# Altium project REACTION-CIRCUIT.PrjPcb
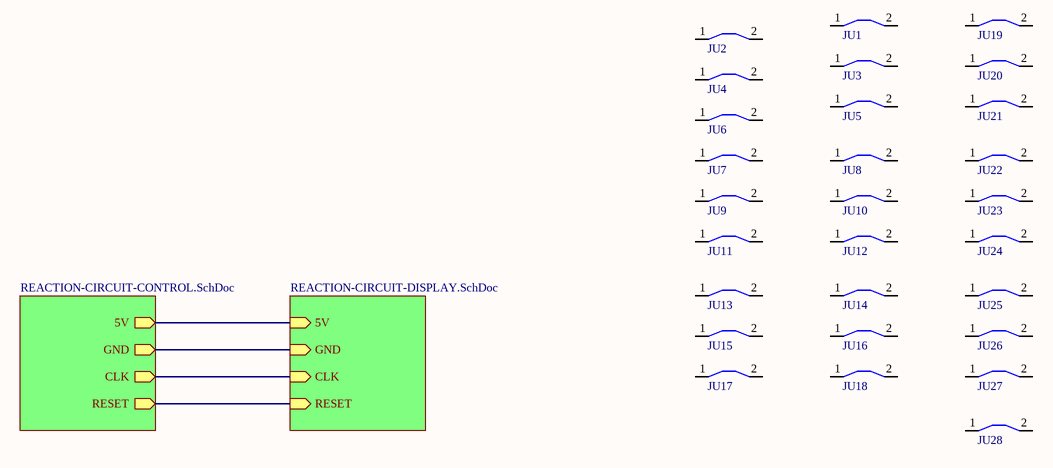
[diagram p0: REACTION-CIRCUIT.SchDoc]
3 sheets, 90 parts. Net scope: hierarchical (ports join the sheet entries above them; power ports are global).
Board file: REACTION-CIRCUIT.PcbDoc
Sheets:
  REACTION-CIRCUIT.SchDoc
    REACTION-CIRCUIT-CONTROL.SchDoc = REACTION-CIRCUIT-CONTROL.SchDoc
    REACTION-CIRCUIT-DISPLAY.SchDoc = REACTION-CIRCUIT-DISPLAY.SchDoc

## Sheet REACTION-CIRCUIT.SchDoc
size A4

### Parts
JU1  JUMPER 5MM  [JUMPER 10MM]  (value not drawn)
JU2  JUMPER 5MM  [JUMPER 10MM]  (value not drawn)
JU3  JUMPER 5MM  [JUMPER 10MM]  (value not drawn)
JU4  JUMPER 5MM  [JUMPER 10MM]  (value not drawn)
JU5  JUMPER 5MM  [JUMPER 5MM]  (value not drawn)
JU6  JUMPER 5MM  [JUMPER 5MM]  (value not drawn)
JU7  JUMPER 5MM  [JUMPER 5MM]  (value not drawn)
JU8  JUMPER 5MM  [JUMPER 5MM]  (value not drawn)
JU9  JUMPER 5MM  [JUMPER 5MM]  (value not drawn)
JU10  JUMPER 5MM  [JUMPER 5MM]  (value not drawn)
JU11  JUMPER 5MM  [JUMPER 5MM]  (value not drawn)
JU12  JUMPER 5MM  [JUMPER 5MM]  (value not drawn)
JU13  JUMPER 5MM  [JUMPER 5MM]  (value not drawn)
JU14  JUMPER 5MM  [JUMPER 5MM]  (value not drawn)
JU15  JUMPER 5MM  [JUMPER 5MM]  (value not drawn)
JU16  JUMPER 5MM  [JUMPER 5MM]  (value not drawn)
JU17  JUMPER 5MM  [JUMPER 5MM]  (value not drawn)
JU18  JUMPER 5MM  [JUMPER 5MM]  (value not drawn)
JU19  JUMPER 5MM  [JUMPER 5MM]  (value not drawn)
JU20  JUMPER 5MM  [JUMPER 5MM]  (value not drawn)
JU21  JUMPER 5MM  [JUMPER 5MM]  (value not drawn)
JU22  JUMPER 5MM  [JUMPER 5MM]  (value not drawn)
JU23  JUMPER 5MM  [JUMPER 5MM]  (value not drawn)
JU24  JUMPER 5MM  [JUMPER 5MM]  (value not drawn)
JU25  JUMPER 5MM  [JUMPER 5MM]  (value not drawn)
JU26  JUMPER 5MM  [JUMPER 5MM]  (value not drawn)
JU27  JUMPER 5MM  [JUMPER 5MM]  (value not drawn)
JU28  JUMPER 5MM  [JUMPER 5MM]  (value not drawn)

### Sub-sheets
REACTION-CIRCUIT-CONTROL.SchDoc = REACTION-CIRCUIT-CONTROL.SchDoc: 5V (out), GND (out), CLK (out), RESET (out)
REACTION-CIRCUIT-DISPLAY.SchDoc = REACTION-CIRCUIT-DISPLAY.SchDoc: 5V (in), GND (in), CLK (in), RESET (in)

### Nets
5V: sheet REACTION-CIRCUIT-CONTROL.SchDoc/5V, sheet REACTION-CIRCUIT-DISPLAY.SchDoc/5V
GND: sheet REACTION-CIRCUIT-CONTROL.SchDoc/GND, sheet REACTION-CIRCUIT-DISPLAY.SchDoc/GND
CLK_1KHz: sheet REACTION-CIRCUIT-CONTROL.SchDoc/CLK, sheet REACTION-CIRCUIT-DISPLAY.SchDoc/CLK
RESET: sheet REACTION-CIRCUIT-CONTROL.SchDoc/RESET, sheet REACTION-CIRCUIT-DISPLAY.SchDoc/RESET

Not connected (* = marked no-connect by the designer): JU1 1 2; JU2 1 2; JU3 1 2; JU4 1 2; JU5 1 2; JU6 1 2; JU7 1 2; JU8 1 2; JU9 1 2; JU10 1 2; JU11 1 2; JU12 1 2; JU13 1 2; JU14 1 2; JU15 1 2; JU16 1 2; JU17 1 2; JU18 1 2; JU19 1 2; JU20 1 2; JU21 1 2; JU22 1 2; JU23 1 2; JU24 1 2; JU25 1 2; JU26 1 2; JU27 1 2; JU28 1 2

## Sheet REACTION-CIRCUIT-CONTROL.SchDoc
size A4
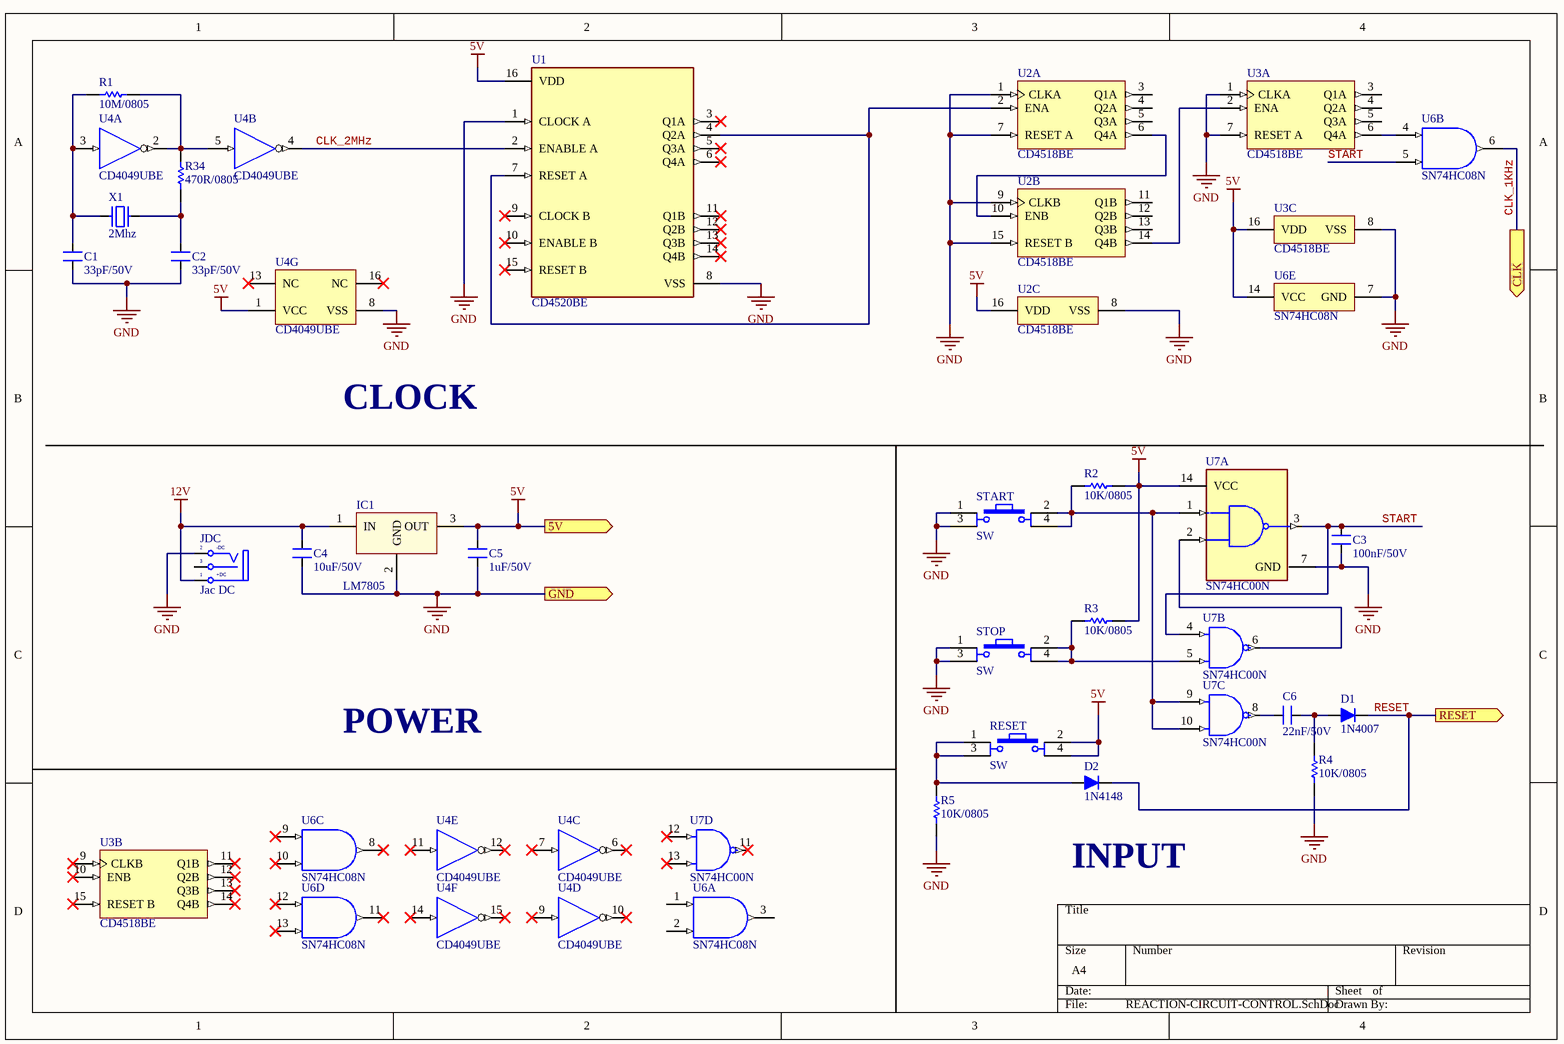
[diagram p1: REACTION-CIRCUIT-CONTROL.SchDoc]

### Parts
C1  33pF/50V  [Cap 0805(2012)]
C2  33pF/50V  [Cap 0805(2012)]
C3  100nF/50V  [Cap 0805(2012)]
C4  10uF/50V  [Cap 0805(2012)]
C5  1uF/50V  [Cap 0805(2012)]
C6  22nF/50V  [Cap 0805(2012)]
D1  1N4007  [1N4007]
D2  1N4148  [1N4007]
IC1  LM7805  [QTO-220H3]
JDC  Jac DC  [DC-IN]
R1  10M/0805  [Res 0805(2012)]
R2  10K/0805  [Res 0805(2012)]
R3  10K/0805  [Res 0805(2012)]
R4  10K/0805  [Res 0805(2012)]
R5  10K/0805  [Res 0805(2012)]
R34  470R/0805  [Res 0805(2012)]
RESET  SW  [SW4B]
START  SW  [SW4B]
STOP  SW  [SW4B]
U1  CD4520BE  [FP-N0016A-MFG]
U2  CD4518BE  [N0016A]  (parts A,B,C of 3)
U3  CD4518BE  [N0016A]  (parts A,B,C of 3)
U4  CD4049UBE  [N0016A]  (parts A,B,C,D,E,F,G of 7)
U6  SN74HC08N  [N0014A]  (parts A,B,C,D,E of 5)
U7  SN74HC00N  [FP-N0014A-MFG]  (parts A,B,C,D of 4)
X1  2Mhz  [XT2]

### Ports
5V (out), CLK (out), GND (out), RESET (out)

### Nets
5V: C5.2 IC1.3(OUT) R2.2 R3.2 RESET.2 RESET.4 U1.16(VDD) U2.16(VDD) U3.16(VDD) U4.1(VCC) U6.14(VCC) U7.14(VCC) ; port 5V
12V: C4.2 IC1.1(IN) JDC.1(T)
GND: C1.1 C2.1 C3.1 C4.1 C5.1 IC1.2(GND) JDC.2(TN) R4.2 R5.2 START.1 START.3 STOP.1 STOP.3 U1.1(CLOCK_A) U1.8(VSS) U2.1(CLKA) U2.7(RESET_A) U2.8(VSS) U2.9(CLKB) U2.15(RESET_B) U3.1(CLKA) U3.7(RESET_A) U3.8(VSS) U4.8(VSS) U6.7(GND) U7.7(GND) ; port GND
CLK_1KHz: U6.6(2Y) ; port CLK
CLK_2MHz: U1.2(ENABLE_A) U4.4(H=~{B})
RESET: D1.2(K) D2.2(K) ; port RESET
START: C3.2 U6.5(2B) U7.3(1Y) U7.4(2A)
NetC1_2: C1.2 R1.2 U4.3(A) X1.1
NetC2_2: C2.2 R34.2 X1.2
NetC6_1: C6.1 D1.1(A) R4.1
NetC6_2: C6.2 U7.8(3Y)
NetD2_1: D2.1(A) R5.1 RESET.1 RESET.3
NetR1_1: R1.1 R34.1 U4.2(G=~{A}) U4.5(B)
NetR2_1: R2.1 START.2 START.4 U7.1(1A) U7.9(3A) U7.10(3B)
NetR3_1: R3.1 STOP.2 STOP.4 U7.5(2B)
NetU1_4: U1.4(Q2A) U1.7(RESET_A) U2.2(ENA)
NetU2_6: U2.6(Q4A) U2.10(ENB)
NetU2_14: U2.14(Q4B) U3.2(ENA)
NetU3_6: U3.6(Q4A) U6.4(2A)
NetU7_2: U7.2(1B) U7.6(2Y)

Not connected (* = marked no-connect by the designer): JDC 3(S); U1 3(Q1A)* 5(Q3A)* 6(Q4A)* 9(CLOCK_B)* 10(ENABLE_B)* 11(Q1B)* 12(Q2B)* 13(Q3B)* 14(Q4B)* 15(RESET_B)*; U2 3(Q1A) 4(Q2A) 5(Q3A) 11(Q1B) 12(Q2B) 13(Q3B); U3 3(Q1A) 4(Q2A) 5(Q3A) 9(CLKB)* 10(ENB)* 11(Q1B)* 12(Q2B)* 13(Q3B)* 14(Q4B)* 15(RESET_B)*; U4 6(I=~{C})* 7(C)* 9(D)* 10(J=~{D})* 11(E)* 12(K=~{E})* 13(NC)* 14(F)* 15(L=~{F})* 16(NC)*; U6 1(1A) 2(1B) 3(1Y) 8(3Y)* 9(3A)* 10(3B)* 11(4Y)* 12(4A)* 13(4B)*; U7 11(4Y)* 12(4A)* 13(4B)*

### Notes on the sheet
- CLOCK
- POWER
- INPUT
- (in symbol DCIN) -DC; +DC

### Library data of the parts
C1-C6 = CAP_CER_1nF_50V_NPOL: Ceramic Capacitor 1nF/50V (+-20% TH)/(+10%SMD)
D1 D2 = 1N4007: Diode LS 1A 1000V DO-41
IC1 = LM78xx: On ap +, from + 5 to + 24VDC; Value: LM7805
JDC = DCIN: Jac DC input; Value: Jac DC
R1-R5 R34 = Resistor 0805
RESET START STOP = SW4: Switch button 4 pin; Value: Button chip 4 pin
U1 = CMP-1623-00555-3: IC DUAL BINARY UP COUNTER 16-DIP; Sync/Async: Synchronous; Power Dissipation: 500mW; Input Capacitance: 5pF; Frequency: 8MHz; Quiescent Current: 100uA; Min Supply Voltage: 3V; Turn-On Delay Time: 650ns; Number of Circuits: 2; Number of Bits: 4; Max Supply Voltage: 18V; Reset: Asynchronous; Logic Function: Counter; Package Quantity: 25; Min Operating Temperature: -55°C; Lead Free: Lead Free; Contact Plating: Gold; RoHS Compliant: Yes; Weight: 0.03357oz; Propagation Delay: 650ns; Number of Elements: 2; Radiation Hardening: No; Max Operating Temperature: 125°C; Mount: Through Hole; Case/Package: PDIP; Number of Pins: 16; REACH SVHC: No SVHC; Direction: Up; Packaging: Rail/Tube; Number of Bits per Element: 4
U2 U3 = CMP-1623-00558-2: CMOS Dual BCD Up-Counter, N0016A, TUBE; Manufacturer: Texas Instruments; Bits(#): 4; Schmitt Trigger: No; Inputs: 1; ICC @ Nom Voltage(Max)(mA): 0.03; Voltage(Nom)(V): 5,10,15; VCC(Min)(V): 3; VCC(Max)(V): 18; Technology Family: CD4000; F @ Nom Voltage(Max)(Mhz): 8; Output Drive (IOL/IOH)(Max)(mA): 1.5/-1.5; tpd @ Nom Voltage(Max)(ns): 230; Rating: Catalog; Output Type: CMOS; DatasheetVersion: SCHS076D; Generic Part Number: CD4518B; Type: Other; Function: Counter; Code_JEDEC: MS-001; Operating Temperature Range(C): -55 to 125; Input Type: CMOS; PackageReference: N0016A
U4 = CMP-1615-00914-2: CMOS Hex Inverting Buffer/Converter, N0016A, TUBE; Manufacturer: Texas Instruments; Rating: Military; Voltage(Nom)(V): 5; VCC(Min)(V): 3; VCC(Max)(V): 18; Output Drive (IOL/IOH)(Max)(mA): -1.2/5.2; ICC @ Nom Voltage(Max)(mA): 0.03; F @ Nom Voltage(Max)(Mhz): 12; tpd @ Nom Voltage(Max)(ns): 120; Technology Family: CD4000; Schmitt Trigger: No; Bits(#): 6; Code_JEDEC: MS-001; DatasheetVersion: SCHS046I; Generic Part Number: CD4049UB; Input Type: CMOS; Output Type: CMOS; PackageReference: N0016A; Operating Temperature Range(C): -55 to 125
U6 = CMP-0777-00250-3: Quadruple 2-Input Positive-AND Gates, N0014A, TUBE; Manufacturer: Texas Instruments; Output Type: CMOS; ICC @ Nom Voltage(Max)(mA): 0.02; tpd @ Nom Voltage(Max)(ns): 28; Voltage(Nom)(V): 5; VCC(Min)(V): 2; Technology Family: HC; F @ Nom Voltage(Max)(Mhz): 70; Rating: Catalog; Bits(#): 4; Schmitt Trigger: No; VCC(Max)(V): 6; PackageReference: N0014A; Input Type: CMOS; Generic Part Number: SN74HC08; DatasheetVersion: SCLS081F; Operating Temperature Range(C): -40 to 85
U7 = CMP-1627-00482-3: IC GATE NAND 4CH 2-INP 14DIP; Quiescent Current: 2uA; High Level Output Current: -5.2mA; Schmitt Trigger Input: No; Turn-On Delay Time: 20ns; Number of Input Lines: 2; Number of Elements: 4; Propagation Delay: 15ns; Low Level Output Current: 5.2mA; Operating Supply Voltage: 5V; Min Supply Voltage: 2V; Max Output Current: 4mA; Max Supply Voltage: 6V; Number of Outputs: 1; Width: 6.35mm; Case/Package: PDIP; Logic Function: NAND; Packaging: Rail/Tube; Number of Bits: 4; Weight: 0.032734oz; Mount: Through Hole; Length: 19.3mm; Contact Plating: Gold; Number of Inputs: 2; Radiation Hardening: No; Number of Pins: 14; Package Quantity: 25; Height: 4.57mm; Lead Free: Lead Free; Number of Circuits: 4; Output Current: 5.2mA; Min Operating Temperature: -40°C; REACH SVHC: No SVHC; Number of Output Lines: 1; Max Operating Temperature: 85°C; Number of Gates: 4
X1 = XT2: Crystal, 32.768 KHz, -40 to 85 degC, 3.2 x 1.5 x 0.9 mm SMD; Value: 4Mhz

## Sheet REACTION-CIRCUIT-DISPLAY.SchDoc
size A4
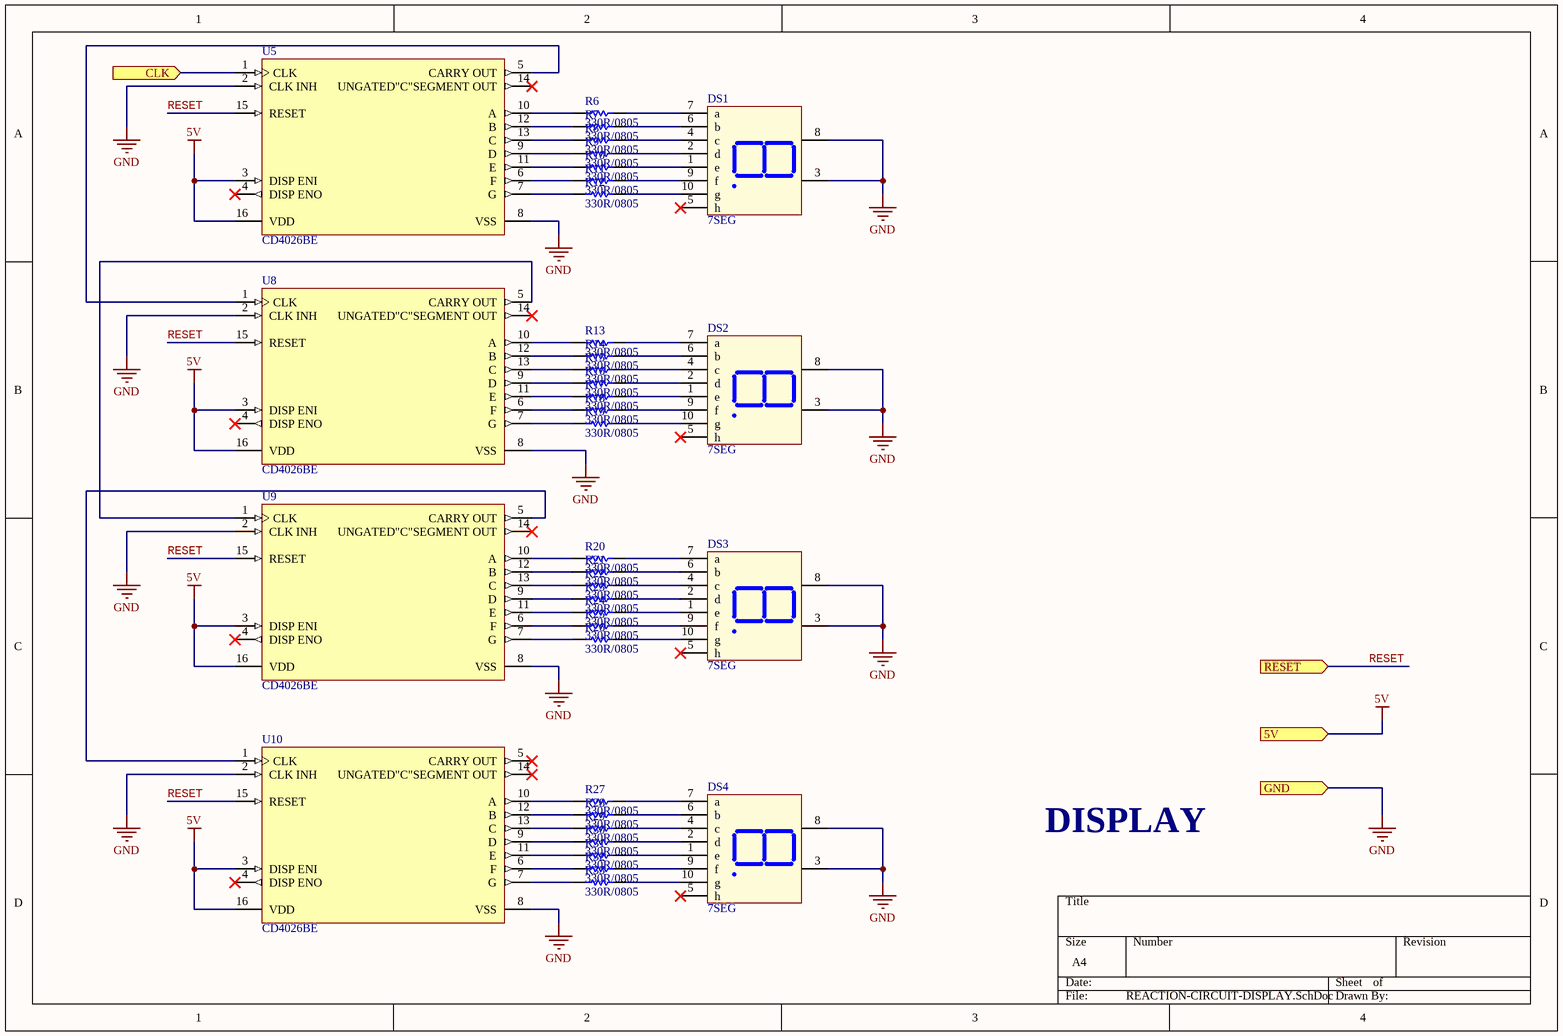
[diagram p2: REACTION-CIRCUIT-DISPLAY.SchDoc]

### Parts
DS1  7SEG  [LED7SEG-1-0.56]
DS2  7SEG  [LED7SEG-1-0.56]
DS3  7SEG  [LED7SEG-1-0.56]
DS4  7SEG  [LED7SEG-1-0.56]
R6  330R/0805  [Res 0805(2012)]
R7  330R/0805  [Res 0805(2012)]
R8  330R/0805  [Res 0805(2012)]
R9  330R/0805  [Res 0805(2012)]
R10  330R/0805  [Res 0805(2012)]
R11  330R/0805  [Res 0805(2012)]
R12  330R/0805  [Res 0805(2012)]
R13  330R/0805  [Res 0805(2012)]
R14  330R/0805  [Res 0805(2012)]
R15  330R/0805  [Res 0805(2012)]
R16  330R/0805  [Res 0805(2012)]
R17  330R/0805  [Res 0805(2012)]
R18  330R/0805  [Res 0805(2012)]
R19  330R/0805  [Res 0805(2012)]
R20  330R/0805  [Res 0805(2012)]
R21  330R/0805  [Res 0805(2012)]
R22  330R/0805  [Res 0805(2012)]
R23  330R/0805  [Res 0805(2012)]
R24  330R/0805  [Res 0805(2012)]
R25  330R/0805  [Res 0805(2012)]
R26  330R/0805  [Res 0805(2012)]
R27  330R/0805  [Res 0805(2012)]
R28  330R/0805  [Res 0805(2012)]
R29  330R/0805  [Res 0805(2012)]
R30  330R/0805  [Res 0805(2012)]
R31  330R/0805  [Res 0805(2012)]
R32  330R/0805  [Res 0805(2012)]
R33  330R/0805  [Res 0805(2012)]
U5  CD4026BE  [N0016A]
U8  CD4026BE  [N0016A]
U9  CD4026BE  [N0016A]
U10  CD4026BE  [N0016A]

### Ports
5V (in), CLK (in), GND (in), RESET (in)

### Nets
5V: U5.3(DISP_ENI) U5.16(VDD) U8.3(DISP_ENI) U8.16(VDD) U9.3(DISP_ENI) U9.16(VDD) U10.3(DISP_ENI) U10.16(VDD) ; port 5V
GND: DS1.3(Vcc) DS1.8(Vcc) DS2.3(Vcc) DS2.8(Vcc) DS3.3(Vcc) DS3.8(Vcc) DS4.3(Vcc) DS4.8(Vcc) U5.2(CLK_INH) U5.8(VSS) U8.2(CLK_INH) U8.8(VSS) U9.2(CLK_INH) U9.8(VSS) U10.2(CLK_INH) U10.8(VSS) ; port GND
CLK_1KHz: U5.1(CLK) ; port CLK
RESET: U5.15(RESET) U8.15(RESET) U9.15(RESET) U10.15(RESET) ; port RESET
NetDS1_1: DS1.1(e) R10.1
NetDS1_2: DS1.2(d) R9.1
NetDS1_4: DS1.4(c) R8.1
NetDS1_6: DS1.6(b) R7.1
NetDS1_7: DS1.7(a) R6.1
NetDS1_9: DS1.9(f) R11.1
NetDS1_10: DS1.10(g) R12.1
NetDS2_1: DS2.1(e) R17.1
NetDS2_2: DS2.2(d) R16.1
NetDS2_4: DS2.4(c) R15.1
NetDS2_6: DS2.6(b) R14.1
NetDS2_7: DS2.7(a) R13.1
NetDS2_9: DS2.9(f) R18.1
NetDS2_10: DS2.10(g) R19.1
NetDS3_1: DS3.1(e) R24.1
NetDS3_2: DS3.2(d) R23.1
NetDS3_4: DS3.4(c) R22.1
NetDS3_6: DS3.6(b) R21.1
NetDS3_7: DS3.7(a) R20.1
NetDS3_9: DS3.9(f) R25.1
NetDS3_10: DS3.10(g) R26.1
NetDS4_1: DS4.1(e) R31.1
NetDS4_2: DS4.2(d) R30.1
NetDS4_4: DS4.4(c) R29.1
NetDS4_6: DS4.6(b) R28.1
NetDS4_7: DS4.7(a) R27.1
NetDS4_9: DS4.9(f) R32.1
NetDS4_10: DS4.10(g) R33.1
NetR6_2: R6.2 U5.10(A)
NetR7_2: R7.2 U5.12(B)
NetR8_2: R8.2 U5.13(C)
NetR9_2: R9.2 U5.9(D)
NetR10_2: R10.2 U5.11(E)
NetR11_2: R11.2 U5.6(F)
NetR12_2: R12.2 U5.7(G)
NetR13_2: R13.2 U8.10(A)
NetR14_2: R14.2 U8.12(B)
NetR15_2: R15.2 U8.13(C)
NetR16_2: R16.2 U8.9(D)
NetR17_2: R17.2 U8.11(E)
NetR18_2: R18.2 U8.6(F)
NetR19_2: R19.2 U8.7(G)
NetR20_2: R20.2 U9.10(A)
NetR21_2: R21.2 U9.12(B)
NetR22_2: R22.2 U9.13(C)
NetR23_2: R23.2 U9.9(D)
NetR24_2: R24.2 U9.11(E)
NetR25_2: R25.2 U9.6(F)
NetR26_2: R26.2 U9.7(G)
NetR27_2: R27.2 U10.10(A)
NetR28_2: R28.2 U10.12(B)
NetR29_2: R29.2 U10.13(C)
NetR30_2: R30.2 U10.9(D)
NetR31_2: R31.2 U10.11(E)
NetR32_2: R32.2 U10.6(F)
NetR33_2: R33.2 U10.7(G)
NetU5_5: U5.5(CARRY_OUT) U8.1(CLK)
NetU8_5: U8.5(CARRY_OUT) U9.1(CLK)
NetU9_5: U9.5(CARRY_OUT) U10.1(CLK)

Not connected (* = marked no-connect by the designer): DS1 5(h)*; DS2 5(h)*; DS3 5(h)*; DS4 5(h)*; U5 4(DISP_ENO)* 14(UNGATED"C"SEGMENT_OUT)*; U8 4(DISP_ENO)* 14(UNGATED"C"SEGMENT_OUT)*; U9 4(DISP_ENO)* 14(UNGATED"C"SEGMENT_OUT)*; U10 4(DISP_ENO)* 5(CARRY_OUT)* 14(UNGATED"C"SEGMENT_OUT)*

### Notes on the sheet
- DISPLAY

### Library data of the parts
DS1-DS4 = LED7SEG-1: 14.2 mm General Purpose Blue 7-Segment Display: CC, RH DP, Gray Surface; MinimumIntensity: 2020 ucd; Note: IF = 10 mA; Published: 8-Jun-2000; LatestRevisionDate: 17-Dec-2003; LatestRevisionNote: Schematic revised, PCB Footprint replaced.; DatasheetDocument: 24-Sep-2002; PackageDocument: 24-Sep-2002; PackageReference: H; Publisher: Altium Limited; Colour: Blue; ComponentLink1Description: Manufacturer Link; ComponentLink1URL: http://www.agilent.com/
R6-R33 = Resistor 0805
U5 U8-U10 = CMP-1623-00561-2: CMOS Decade Counter/Divider with Decoded 7-Segment Display Outputs and Display Enable, N0016A, TUBE; Manufacturer: Texas Instruments; ICC @ Nom Voltage(Max)(mA): 0.03; tpd @ Nom Voltage(Max)(ns): 250; F @ Nom Voltage(Max)(Mhz): 8; Bits(#): 7; VCC(Max)(V): 18; VCC(Min)(V): 3; Output Drive (IOL/IOH)(Max)(mA): 1.5/-1.5; Inputs: 1; Rating: Catalog; Technology Family: CD4000; Schmitt Trigger: No; Voltage(Nom)(V): 5,10,15; DatasheetVersion: SCHS031B; Operating Temperature Range(C): -55 to 125; Code_JEDEC: MS-001; Input Type: CMOS; Output Type: CMOS; Type: Decade; Generic Part Number: CD4026B; PackageReference: N0016A; Function: Counter

## Nets that join several sheets
5V: REACTION-CIRCUIT-CONTROL (12 pins), REACTION-CIRCUIT-DISPLAY (8 pins)
GND: REACTION-CIRCUIT-CONTROL (26 pins), REACTION-CIRCUIT-DISPLAY (16 pins)
CLK_1KHz: REACTION-CIRCUIT-CONTROL (U6.6), REACTION-CIRCUIT-DISPLAY (U5.1)
RESET: REACTION-CIRCUIT-CONTROL (D1.2 D2.2), REACTION-CIRCUIT-DISPLAY (U5.15 U8.15 U9.15 U10.15)